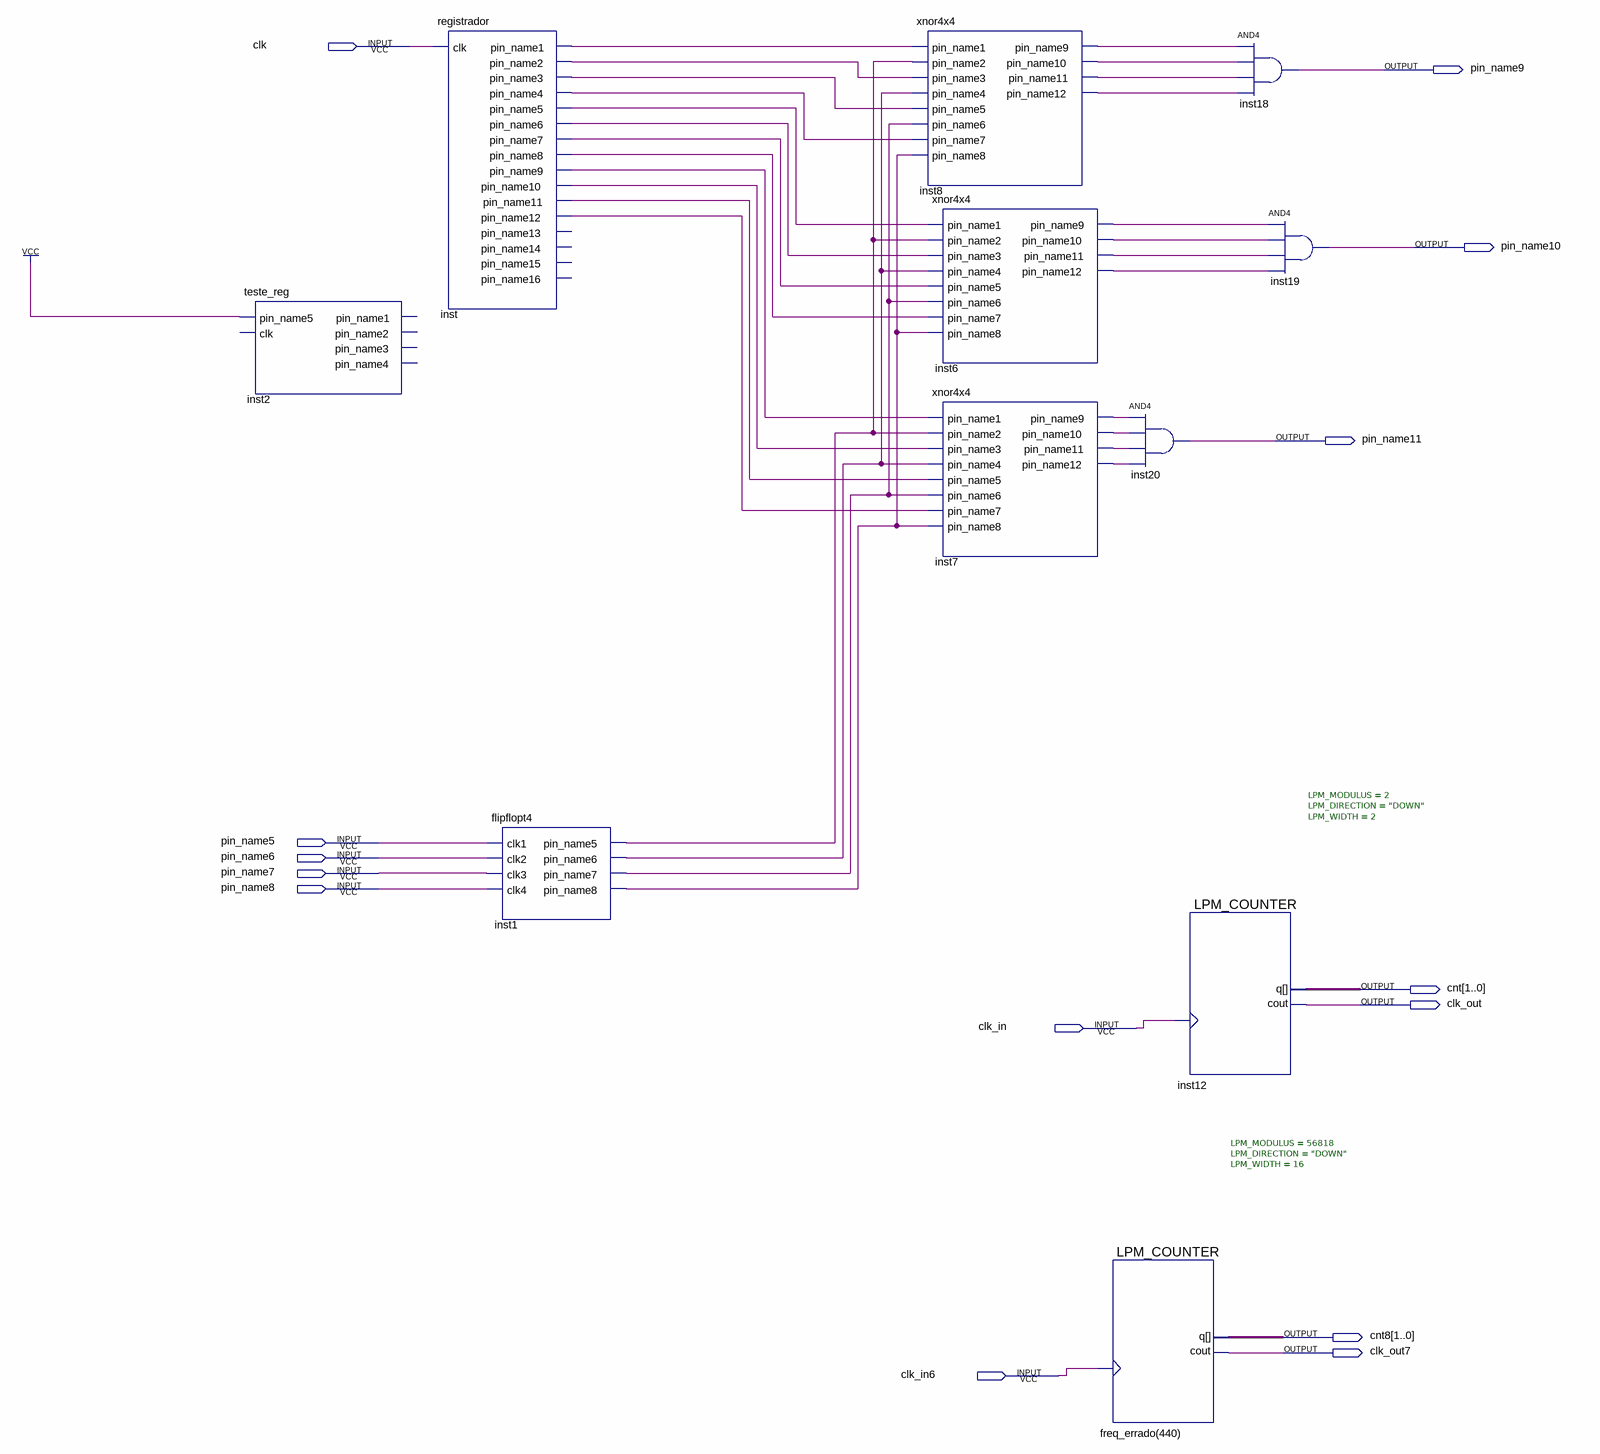
[diagram p0: schematic sheet]
// Quartus schematic Projeto1.bdf as structural Verilog: 11 symbols, 14 pins
module Projeto1 (
  input  clk,
  input  pin_name5,
  input  pin_name6,
  input  pin_name7,
  input  pin_name8,
  input  clk_in,
  input  clk_in6,
  output pin_name9,
  output pin_name10,
  output pin_name11,
  output [1:0] cnt,
  output clk_out,
  output [1:0] cnt8,
  output clk_out7
);

  wire inst1_pin_name5, inst1_pin_name6, inst1_pin_name7, inst1_pin_name8, inst6_pin_name9, inst6_pin_name10,
       inst6_pin_name11, inst6_pin_name12, inst7_pin_name9, inst7_pin_name10, inst7_pin_name11,
       inst7_pin_name12, inst8_pin_name9, inst8_pin_name10, inst8_pin_name11, inst8_pin_name12,
       inst_pin_name1, inst_pin_name2, inst_pin_name3, inst_pin_name4, inst_pin_name5, inst_pin_name6,
       inst_pin_name7, inst_pin_name8, inst_pin_name9, inst_pin_name10, inst_pin_name11, inst_pin_name12;

  teste_reg inst2 (.pin_name5(1'b1));  // open: clk, pin_name1, pin_name2, pin_name3, pin_name4
  registrador inst (
    .clk(clk), .pin_name1(inst_pin_name1), .pin_name2(inst_pin_name2), .pin_name3(inst_pin_name3),
    .pin_name4(inst_pin_name4), .pin_name5(inst_pin_name5), .pin_name6(inst_pin_name6),
    .pin_name7(inst_pin_name7), .pin_name8(inst_pin_name8), .pin_name9(inst_pin_name9),
    .pin_name10(inst_pin_name10), .pin_name11(inst_pin_name11), .pin_name12(inst_pin_name12));  // open: pin_name13, pin_name14, pin_name15, pin_name16
  flipflopt4 inst1 (
    .clk1(pin_name5), .clk2(pin_name6), .clk3(pin_name7), .clk4(pin_name8), .pin_name5(inst1_pin_name5),
    .pin_name6(inst1_pin_name6), .pin_name7(inst1_pin_name7), .pin_name8(inst1_pin_name8));
  xnor4x4 inst8 (
    .pin_name1(inst_pin_name1), .pin_name2(inst1_pin_name5), .pin_name3(inst_pin_name2),
    .pin_name4(inst1_pin_name6), .pin_name5(inst_pin_name3), .pin_name6(inst1_pin_name7),
    .pin_name7(inst_pin_name4), .pin_name8(inst1_pin_name8), .pin_name9(inst8_pin_name9),
    .pin_name10(inst8_pin_name10), .pin_name11(inst8_pin_name11), .pin_name12(inst8_pin_name12));
  xnor4x4 inst6 (
    .pin_name1(inst_pin_name5), .pin_name2(inst1_pin_name5), .pin_name3(inst_pin_name6),
    .pin_name4(inst1_pin_name6), .pin_name5(inst_pin_name7), .pin_name6(inst1_pin_name7),
    .pin_name7(inst_pin_name8), .pin_name8(inst1_pin_name8), .pin_name9(inst6_pin_name9),
    .pin_name10(inst6_pin_name10), .pin_name11(inst6_pin_name11), .pin_name12(inst6_pin_name12));
  xnor4x4 inst7 (
    .pin_name1(inst_pin_name9), .pin_name2(inst1_pin_name5), .pin_name3(inst_pin_name10),
    .pin_name4(inst1_pin_name6), .pin_name5(inst_pin_name11), .pin_name6(inst1_pin_name7),
    .pin_name7(inst_pin_name12), .pin_name8(inst1_pin_name8), .pin_name9(inst7_pin_name9),
    .pin_name10(inst7_pin_name10), .pin_name11(inst7_pin_name11), .pin_name12(inst7_pin_name12));
  and inst20 (pin_name11, inst7_pin_name9, inst7_pin_name10, inst7_pin_name11, inst7_pin_name12);
  LPM_COUNTER #(.LPM_MODULUS(56818), .LPM_DIRECTION("DOWN"), .LPM_WIDTH(16)) \freq_errado(440)  (
    .clock(clk_in6), .cout(clk_out7), .q(cnt8));
  LPM_COUNTER #(.LPM_MODULUS(2), .LPM_DIRECTION("DOWN"), .LPM_WIDTH(2)) inst12 (
    .clock(clk_in), .cout(clk_out), .q(cnt));
  and inst18 (pin_name9, inst8_pin_name9, inst8_pin_name10, inst8_pin_name11, inst8_pin_name12);
  and inst19 (pin_name10, inst6_pin_name9, inst6_pin_name10, inst6_pin_name11, inst6_pin_name12);
endmodule
